# EAGLE design UltiMem64_Color_CPLD (EAGLE 7.7.0)
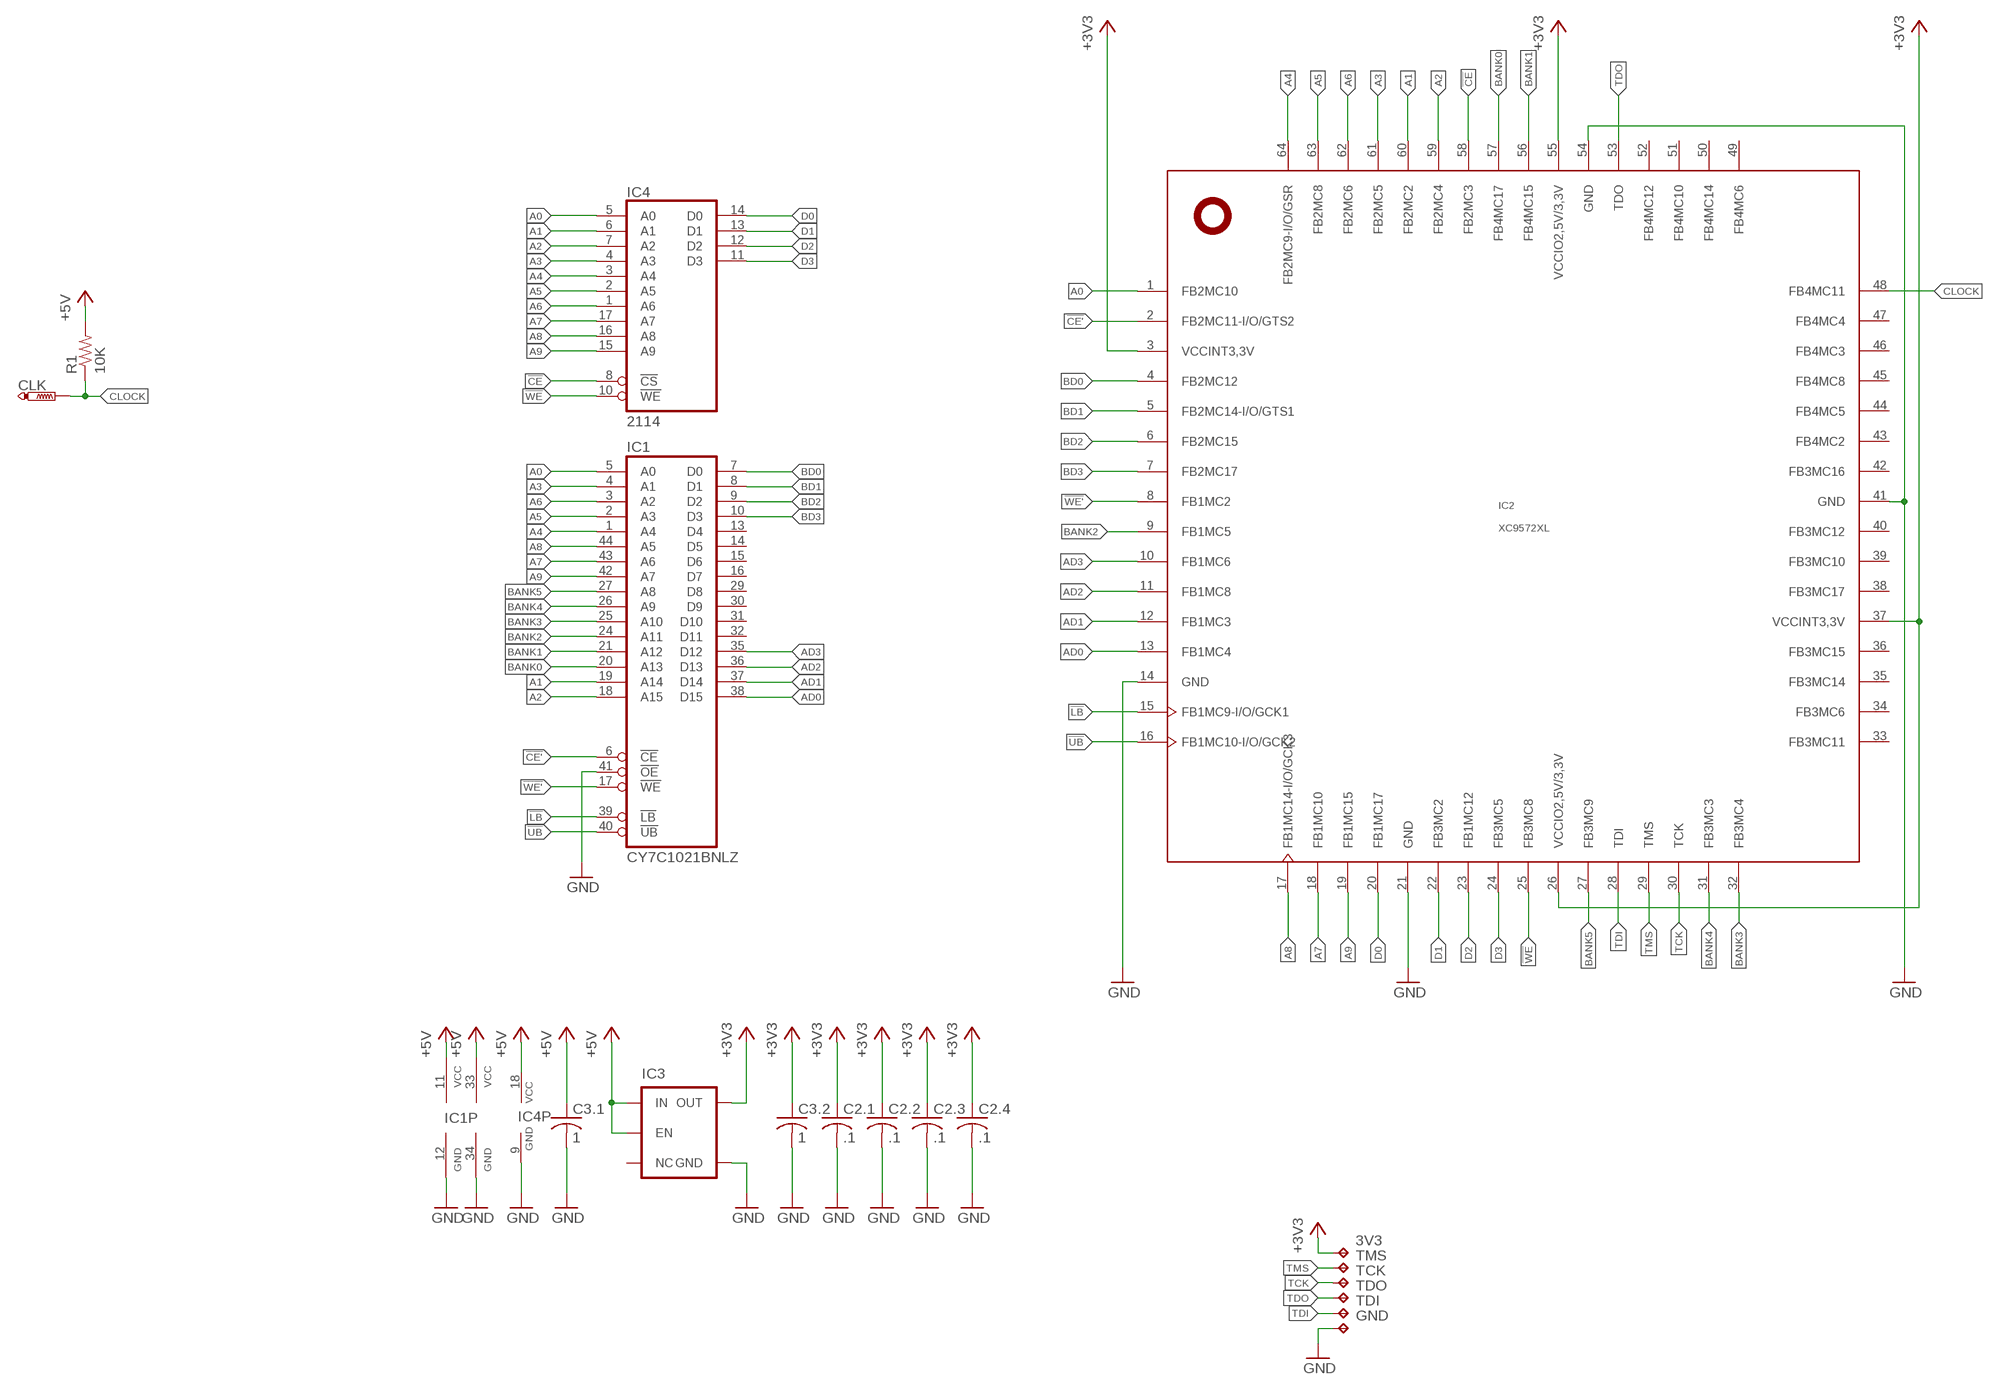
[diagram p0: schematic, sheet 1]

## Parts
3V3  TPTP09R  [TP09R]
C2.1  .1  C-USC0402  [C0402]
C2.2  .1  C-USC0402  [C0402]
C2.3  .1  C-USC0402  [C0402]
C2.4  .1  C-USC0402  [C0402]
C3.1  1  C-USC0402  [C0402]
C3.2  1  C-USC0402  [C0402]
CLK  PTR1PAD1-13  [P1-13]
GND  TPTP09R  [TP09R]
IC1  CY7C1021BNLZ  [TSOP44-II]
IC2  XC9572XL  XC9572XLVQG64  [VQFP64]
IC3  V_REG_TPS76433SOT23-5  [SOT23-5]
IC4  2114  2114-S  [DIL18-SMD-REVERSE]
R1  10K  R-US_R0402  [R0402]
TCK  TPTP09R  [TP09R]
TDI  TPTP09R  [TP09R]
TDO  TPTP09R  [TP09R]
TMS  TPTP09R  [TP09R]

## Nets
!CE: IC2.58(FB2MC3) IC4.8(!CS)
!CE': IC1.6(!CE) IC2.2(FB2MC11-I/O/GTS2)
!LB: IC1.39(!LB) IC2.15(FB1MC9-I/O/GCK1)
!UB: IC1.40(!UB) IC2.16(FB1MC10-I/O/GCK2)
!WE: IC2.25(FB3MC8) IC4.10(!WE)
!WE': IC1.17(!WE) IC2.8(FB1MC2)
+3V3: 3V3.TP C2.1.1 C2.2.1 C2.3.1 C2.4.1 C3.2.1 IC2.3(VCCINT3,3V) IC2.26(VCCIO2,5V/3,3V) IC2.37(VCCINT3,3V) IC2.55(VCCIO2,5V/3,3V) IC3.5(OUT)
+5V: C3.1.1 IC1.11(VCC) IC1.33(VCC) IC3.1(IN) IC3.3(EN) IC4.18(VCC) R1.2
A0: IC1.5(A0) IC2.1(FB2MC10) IC4.5(A0)
A1: IC1.19(A14) IC2.60(FB2MC2) IC4.6(A1)
A2: IC1.18(A15) IC2.59(FB2MC4) IC4.7(A2)
A3: IC1.4(A1) IC2.61(FB2MC5) IC4.4(A3)
A4: IC1.1(A4) IC2.64(FB2MC9-I/O/GSR) IC4.3(A4)
A5: IC1.2(A3) IC2.63(FB2MC8) IC4.2(A5)
A6: IC1.3(A2) IC2.62(FB2MC6) IC4.1(A6)
A7: IC1.43(A6) IC2.18(FB1MC10) IC4.17(A7)
A8: IC1.44(A5) IC2.17(FB1MC14-I/O/GCK3) IC4.16(A8)
A9: IC1.42(A7) IC2.19(FB1MC15) IC4.15(A9)
AD0: IC1.38(D15) IC2.13(FB1MC4)
AD1: IC1.37(D14) IC2.12(FB1MC3)
AD2: IC1.36(D13) IC2.11(FB1MC8)
AD3: IC1.35(D12) IC2.10(FB1MC6)
BANK0: IC1.20(A13) IC2.57(FB4MC17)
BANK1: IC1.21(A12) IC2.56(FB4MC15)
BANK2: IC1.24(A11) IC2.9(FB1MC5)
BANK3: IC1.25(A10) IC2.32(FB3MC4)
BANK4: IC1.26(A9) IC2.31(FB3MC3)
BANK5: IC1.27(A8) IC2.27(FB3MC9)
BD0: IC1.7(D0) IC2.4(FB2MC12)
BD1: IC1.8(D1) IC2.5(FB2MC14-I/O/GTS1)
BD2: IC1.9(D2) IC2.6(FB2MC15)
BD3: IC1.10(D3) IC2.7(FB2MC17)
CLOCK: CLK.TP IC2.48(FB4MC11) R1.1
D0: IC2.20(FB1MC17) IC4.14(D0)
D1: IC2.22(FB3MC2) IC4.13(D1)
D2: IC2.23(FB1MC12) IC4.12(D2)
D3: IC2.24(FB3MC5) IC4.11(D3)
GND: C2.1.2 C2.2.2 C2.3.2 C2.4.2 C3.1.2 C3.2.2 GND.TP IC1.12(GND) IC1.34(GND) IC1.41(!OE) IC2.14(GND) IC2.21(GND) IC2.41(GND) IC2.54(GND) IC3.2(GND) IC4.9(GND)
TCK: IC2.30(TCK) TCK.TP
TDI: IC2.28(TDI) TDI.TP
TDO: IC2.53(TDO) TDO.TP
TMS: IC2.29(TMS) TMS.TP
Unconnected: IC1.13(D4) IC1.14(D5) IC1.15(D6) IC1.16(D7) IC1.29(D8) IC1.30(D9) IC1.31(D10) IC1.32(D11) IC2.33(FB3MC11) IC2.34(FB3MC6) IC2.35(FB3MC14) IC2.36(FB3MC15) IC2.38(FB3MC17) IC2.39(FB3MC10) IC2.40(FB3MC12) IC2.42(FB3MC16) IC2.43(FB4MC2) IC2.44(FB4MC5) IC2.45(FB4MC8) IC2.46(FB4MC3) IC2.47(FB4MC4) IC2.49(FB4MC6) IC2.50(FB4MC14) IC2.51(FB4MC10) IC2.52(FB4MC12) IC3.4(NC)

## Library data of the parts
3V3 GND TCK TDI TDO TMS = testpad:TP: Test pad
C2.1-C2.4 C3.1 C3.2 = resistor:C-US: CAPACITOR, American symbol
CLK = testpad:PTR1: TEST PIN
IC1 = memory-cypress-jlb:CY7C1021BNL
IC2 = xilinx_xc95XXXxl:XC9572XLVQG64
IC3 = SparkFun:V_REG_TPS76433: Voltage Regulator Older TI part. LDO 150mA regulator. No output by-pass cap option. See V_REG_LDO for a better part.
IC4 = memory:2114: MEMORY
R1 = resistor:R-US_: RESISTOR, American symbol

## Board
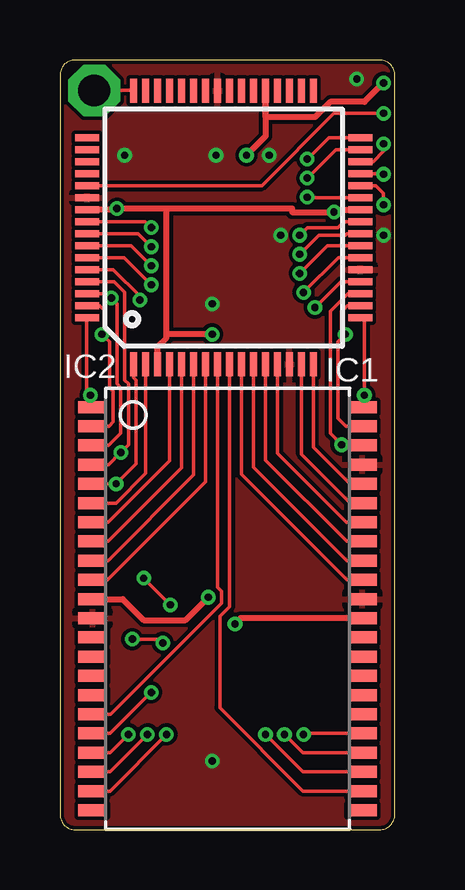
[diagram p1: board, top side]
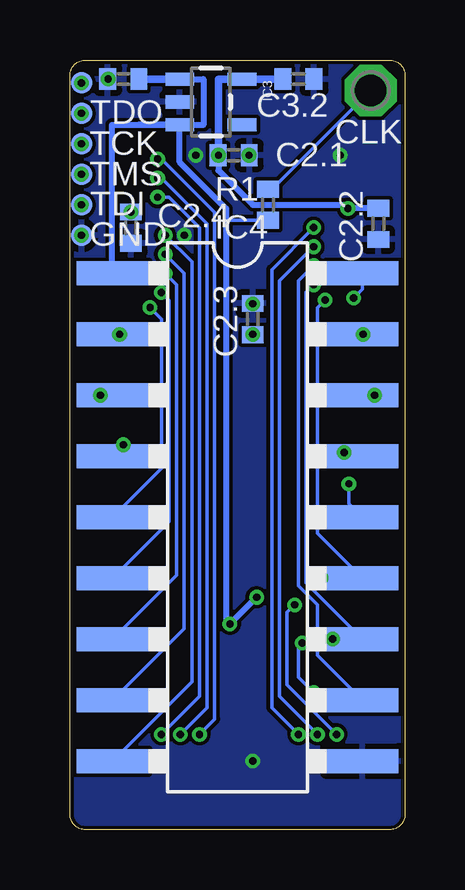
[diagram p2: board, bottom side, seen from below]

Size 13.97 x 32.07 mm. Coordinates in mm from the lower left corner, seen from the top.
Outline: 0,31.43 0,0.63 arc90 0.64,0 13.34,0 arc90 13.97,0.63 13.97,31.43 arc90 13.34,32.07 0.64,32.07 arc90 0,31.43
Copper layers (1*16): Top 0.035mm / dielectric 1.5mm / Bottom 0.035mm
Design rules "hackvana *": minimum track width 6mil, minimum drill 0.3mm, track to track 6mil, track to pad 6mil, pad to pad 6mil, via to via 6mil, smd to smd 0mil, copper to edge 6mil, drill to drill 6mil, minimum pad ring 10mil, minimum via ring 6mil, stop-mask expansion 2mil, vias tented up to drill 100mil, thermal gap 10mil

### Footprints (pad centres in the part's own frame; a part is rotated, then mirrored left to right if it is on the bottom)
TP09R = smd 0.9 x 0.9: TP 0,0
C0402 = smd 0.7 x 0.9: 1 -0.65,0; 2 0.65,0
P1-13 = drill 1.321 pad 2.159 octagon: TP 0,0
TSOP44-II = smd 0.5 x 1.2: 1 -8.4,-5.627; 2 -7.6,-5.627; 3 -6.8,-5.627; 4 -6,-5.627; 5 -5.2,-5.627; 6 -4.4,-5.627; 7 -3.6,-5.627; 8 -2.8,-5.627; 9 -2,-5.627; 10 -1.2,-5.627; 11 -0.4,-5.627; 12 0.4,-5.627; 13 1.2,-5.627; 14 2,-5.627; 15 2.8,-5.627; 16 3.6,-5.627; 17 4.4,-5.627; 18 5.2,-5.627; 19 6,-5.627; 20 6.8,-5.627; 21 7.6,-5.627; 22 8.4,-5.627; 23 8.4,5.627; 24 7.6,5.627; 25 6.8,5.627; 26 6,5.627; 27 5.2,5.627; 28 4.4,5.627; 29 3.6,5.627; 30 2.8,5.627; 31 2,5.627; 32 1.2,5.627; 33 0.4,5.627; 34 -0.4,5.627; 35 -1.2,5.627; 36 -2,5.627; 37 -2.8,5.627; 38 -3.6,5.627; 39 -4.4,5.627; 40 -5.2,5.627; 41 -6,5.627; 42 -6.8,5.627; 43 -7.6,5.627; 44 -8.4,5.627
VQFP64 = smd 1 x 0.3: 1 -5.7,3.75; 2 -5.7,3.25; 3 -5.7,2.75; 4 -5.7,2.25; 5 -5.7,1.75; 6 -5.7,1.25; 7 -5.7,0.75; 8 -5.7,0.25; 9 -5.7,-0.25; 10 -5.7,-0.75; 11 -5.7,-1.25; 12 -5.7,-1.75; 13 -5.7,-2.25; 14 -5.7,-2.75; 15 -5.7,-3.25; 16 -5.7,-3.75; 33 5.7,-3.75; 34 5.7,-3.25; 35 5.7,-2.75; 36 5.7,-2.25; 37 5.7,-1.75; 38 5.7,-1.25; 39 5.7,-0.75; 40 5.7,-0.25; 41 5.7,0.25; 42 5.7,0.75; 43 5.7,1.25; 44 5.7,1.75; 45 5.7,2.25; 46 5.7,2.75; 47 5.7,3.25; 48 5.7,3.75 | smd 0.3 x 1: 17 -3.75,-5.7; 18 -3.25,-5.7; 19 -2.75,-5.7; 20 -2.25,-5.7; 21 -1.75,-5.7; 22 -1.25,-5.7; 23 -0.75,-5.7; 24 -0.25,-5.7; 25 0.25,-5.7; 26 0.75,-5.7; 27 1.25,-5.7; 28 1.75,-5.7; 29 2.25,-5.7; 30 2.75,-5.7; 31 3.25,-5.7; 32 3.75,-5.7; 49 3.75,5.7; 50 3.25,5.7; 51 2.75,5.7; 52 2.25,5.7; 53 1.75,5.7; 54 1.25,5.7; 55 0.75,5.7; 56 0.25,5.7; 57 -0.25,5.7; 58 -0.75,5.7; 59 -1.25,5.7; 60 -1.75,5.7; 61 -2.25,5.7; 62 -2.75,5.7; 63 -3.25,5.7; 64 -3.75,5.7
SOT23-5 = smd 0.55 x 1.2: 1 -0.95,-1.3; 2 0,-1.3; 3 0.95,-1.3; 4 0.95,1.3; 5 -0.95,1.3
DIL18-SMD-REVERSE = smd 1 x 3 bottom: 1 -8.89,-5.205; 2 -6.35,-5.205; 3 -3.81,-5.205; 4 -1.27,-5.205; 5 1.27,-5.205; 6 3.81,-5.205; 7 6.35,-5.205; 8 8.89,-5.205; 9 11.43,-5.205; 10 11.43,5.205; 11 8.89,5.205; 12 6.35,5.205; 13 3.81,5.205; 14 1.27,5.205; 15 -1.27,5.205; 16 -3.81,5.205; 17 -6.35,5.205; 18 -8.89,5.205
R0402 = smd 0.7 x 0.9: 1 -0.65,0; 2 0.65,0

### Placement (x,y rotation side)
3V3  13.49,31.11 270 bottom
C2.1  7.14,28.1 0 bottom
C2.2  1.11,25.24 270 bottom
C2.3  6.35,21.27 90 bottom
C2.4  11.43,25.08 270 bottom
C3.1  11.75,31.27 180 bottom
C3.2  4.45,31.27 0 bottom
CLK  1.43,30.8 0 bottom
GND  13.49,24.76 270 bottom
IC1  6.99,9.21 270 top
IC2  6.83,25.08 90 top
IC3  8.1,30.32 270 bottom
IC4  6.99,14.29 270 top
R1  5.71,26.04 270 bottom
TCK  13.49,28.57 270 bottom
TDI  13.49,26.04 270 bottom
TDO  13.49,29.84 270 bottom
TMS  13.49,27.3 270 bottom

### Tracks (layer width: path | path; a pad name or v marks a point on that pad's centre or on a via)
!CE  (via drill 0.3)
  Top 0.152: IC2.58 2.97,24.33 v3.81,23.49
  Bottom 0.152: IC4.8 3.65,7.27 3.65,9.37 4.45,10.16 4.45,22.86 v3.81,23.49
!CE'
  Top 0.152: IC2.2 3.58,14.85 2.34,13.61 IC1.6
!LB
  Top 0.152: IC1.39 12.11,13.61 10.08,15.64 IC2.15
!UB
  Top 0.152: IC1.40 12.1,14.41 10.58,15.94 IC2.16
!WE  (via drill 0.3)
  Top 0.152: IC2.25 11.84,25.33 11.59,25.08 10.32,25.08 v10,24.76
  Bottom 0.152: IC4.10 8.89,6.16 8.89,23.65 v10,24.76
!WE'
  Top 0.152: IC1.17 2.11,4.81 6.74,9.43 6.74,9.93 6.58,10.09 IC2.8
+3V3  (via drill 0.3)
  Top 0.254: 2.34,25.83 IC2.55 | IC2.3 4.08,20.11 4.45,20.48 4.45,20.64 | 4.45,20.64 4.45,25.88 | 4.45,25.88 v2.38,25.88 | 4.45,25.88 9.68,25.88 9.68,25.73 C2.4.1 11.53,25.83 IC2.26 | v6.35,20.64 4.45,20.64 | v7.78,28.1 8.57,28.89 8.58,28.89 IC2.37 8.58,29.69 10.64,29.69 11.27,30.32 12.7,30.32 3V3.TP
  Top 0.305: v2.38,25.88 2.34,25.83
  Bottom 0.254: C2.2.1 2.37,25.89 | C2.1.1 v7.78,28.1 7.78,27.46 6.35,26.04 2.38,26.04 v2.38,25.88 | C2.3.1 v6.35,20.64
  Bottom 0.305: C3.2.1 IC3.5 7.78,31.27 v7.78,28.1 | 2.37,25.89 v2.38,25.88
  other vias: 11.43,25.73 13.49,31.11
+5V  (via drill 0.3)
  Top 0.254: IC1.11 2.62,9.61 3.49,8.73 5.24,8.73 v6.19,9.68 | IC1.33 7.54,8.81 v7.3,8.57
  Bottom 0.152: R1.2 7.46,25.38
  Bottom 0.254: IC4.18 12.22,23.18 12.22,29.37 IC3.3 | IC3.3 11.1,29.37 | v6.19,9.68 v7.3,8.57 7.46,8.57 7.46,25.38 7.46,25.88 9.4,27.81 IC3.3 | C3.1.1 8.41,31.27 8.41,29.37 | 8.41,29.37 | IC3.3 8.41,29.37
  Bottom 0.305: C3.1.1 IC3.1
A0  (via drill 0.3)
  Top 0.152: IC2.1 3.08,18.83 3.17,18.73 3.17,15.24 v2.34,14.41 IC1.5
  Bottom 0.152: IC4.5 2.34,13.58 v2.34,14.41
A1  (via drill 0.3)
  Top 0.152: IC1.19 2.1,3.21 v2.86,3.97 | v3.49,10.48 v4.6,9.37 | IC2.60 2.23,23.33 3.33,22.22 v3.33,22.07
  Bottom 0.152: v3.49,10.48 IC4.6 3.65,12.35 3.65,21.75 v3.33,22.07 | v4.6,9.37 4.92,9.05 4.92,6.03 v2.86,3.97
A2  (via drill 0.3)
  Top 0.152: IC1.18 2.1,4.01 v3.81,5.72 | v3.02,7.94 4.13,7.94 v4.29,7.78 | IC2.59 2.68,23.83 v3.81,22.7
  Bottom 0.152: v3.02,7.94 IC4.7 4.13,10.28 4.13,22.38 v3.81,22.7 | v4.29,7.78 4.45,7.62 4.45,6.35 v3.81,5.72
A3  (via drill 0.3)
  Top 0.152: IC1.4 2.03,15.21 v2.54,15.72 2.86,16.03 2.86,18.57 2.7,18.73 2.7,22.38 2.25,22.83 IC2.61
  Bottom 0.152: IC4.4 2.38,15.56 v2.54,15.72
A4  (via drill 0.3)
  Top 0.152: 1.36,17.62 IC1.1 1.36,18.1 v1.27,18.1 1.11,18.26 1.11,21.33 IC2.64 1.27,21.33
  Bottom 0.152: v1.27,18.1 IC4.3
A5  (via drill 0.3)
  Top 0.152: IC1.2 2.04,16.81 2.22,16.99 2.22,18.26 2.06,18.42 2.06,20.32 v1.75,20.64 1.91,20.8 1.91,21.59 1.66,21.83 IC2.63
  Bottom 0.152: v1.75,20.64 IC4.2
A6  (via drill 0.3)
  Top 0.152: IC2.62 1.96,22.33 v2.14,22.15 2.38,21.91 2.38,18.57 2.54,18.42 2.54,16.51 2.04,16.01 IC1.3
  Bottom 0.152: IC4.1 1.78,22.51 v2.14,22.15
A7  (via drill 0.3)
  Top 0.152: IC1.43 11.93,16.81 11.59,17.14 11.59,20.32 v11.91,20.64 11.75,20.8 11.75,21.59 11.99,21.83 IC2.18
  Bottom 0.152: v11.91,20.64 IC4.17
A8  (via drill 0.3)
  Top 0.152: IC1.44 12.61,18.1 v12.7,18.1 12.7,21.33 IC2.17
  Bottom 0.152: v12.7,18.1 IC4.16
A9  (via drill 0.3)
  Top 0.152: IC1.42 11.77,16.01 v11.75,16.03 11.27,16.51 11.27,21.59 12.01,22.33 IC2.19
  Bottom 0.152: IC4.15 12.19,15.59 v11.75,16.03
AD0
  Top 0.152: IC2.13 9.08,15.69 11.96,12.81 IC1.38
AD1
  Top 0.152: IC2.12 8.58,15.39 11.96,12.01 IC1.37
AD2
  Top 0.152: IC2.11 8.08,15.1 11.97,11.21 IC1.36
AD3
  Top 0.152: IC2.10 7.58,14.81 11.98,10.41 IC1.35
BANK0  (via drill 0.3)
  Top 0.152: IC1.20 2.09,2.41 v3.65,3.97 | IC2.57 3.27,24.83 v3.81,24.29
  Bottom 0.152: v3.65,3.97 5.24,5.56 5.24,22.86 v3.81,24.29
BANK1  (via drill 0.3)
  Top 0.152: IC1.21 2.08,1.61 v4.45,3.97 | IC2.56 3.56,25.33 v3.81,25.08
  Bottom 0.152: v4.45,3.97 5.56,5.08 5.56,23.34 v3.81,25.08
BANK2
  Top 0.152: IC1.24 10.14,1.61 6.67,5.08 6.67,8.89 7.06,9.29 7.08,9.29 IC2.9
BANK3  (via drill 0.3)
  Top 0.152: IC1.25 10.13,2.41 v8.57,3.97 | IC2.32 11.21,28.83 v10.32,27.94
  Bottom 0.152: v8.57,3.97 7.94,4.6 7.94,25.72 10.16,27.94 v10.32,27.94
BANK4  (via drill 0.3)
  Top 0.152: IC1.26 10.13,3.21 v9.37,3.97 | IC2.31 11.51,28.33 v10.32,27.15
  Bottom 0.152: v9.37,3.97 8.26,5.08 8.26,25.24 10.16,27.15 v10.32,27.15
BANK5  (via drill 0.3)
  Top 0.152: IC1.27 10.2,4.01 v10.16,3.97 | IC2.27 10.3,26.33 v10.32,26.35
  Bottom 0.152: v10.16,3.97 8.57,5.56 8.57,25.08 9.84,26.35 v10.32,26.35
BD0
  Top 0.152: IC2.4 4.58,15.37 2.01,12.81 IC1.7
BD1
  Top 0.152: IC2.5 5.08,15.08 2.01,12.01 IC1.8
BD2
  Top 0.152: IC2.6 5.58,14.78 2,11.21 IC1.9
BD3
  Top 0.152: IC2.7 6.08,14.49 1.99,10.41 IC1.10
CLOCK
  Top 0.152: IC2.48 3.06,30.8 CLK.TP
  Bottom 0.152: CLK.TP 5.54,26.69 R1.1
D0  (via drill 0.3)
  Top 0.152: IC2.20 11.72,22.83 v10.64,21.75
  Bottom 0.152: IC4.14 10.16,15.05 10.16,21.27 v10.64,21.75
D1  (via drill 0.3)
  Top 0.152: IC2.22 11.61,23.83 v10.16,22.38
  Bottom 0.152: IC4.13 9.84,12.83 9.84,22.07 v10.16,22.38
D2  (via drill 0.3)
  Top 0.152: IC2.23 11.16,24.33 v10,23.18
  Bottom 0.152: IC4.12 9.53,10.6 9.53,22.7 v10,23.18
D3  (via drill 0.3)
  Top 0.152: IC2.24 11.97,24.83 11.91,24.76 10.79,24.76 v10,23.97
  Bottom 0.152: IC4.11 9.21,8.38 9.21,23.18 v10,23.97
GND  (via drill 0.3)
  other vias: 13.49,24.76 6.35,2.86 6.35,21.91 8.73,28.1 9.21,24.76 6.51,28.1 12.38,31.27 2.7,28.1
  pour Top: 13.97,31.43 13.97,0.63 arc-90 13.34,0 0.64,0 arc-90 0,0.63 0,31.43 arc-90 0.64,32.07 13.34,32.07 arc-90
  pour Bottom: 13.97,31.43 13.97,0.63 arc-90 13.34,0 0.64,0 arc-90 0,0.63 0,31.43 arc-90 0.64,32.07 13.34,32.07 arc-90
TCK  (via drill 0.3)
  Top 0.152: IC2.30 13.07,27.83 13.49,28.26 TCK.TP
  other vias: 13.49,28.57
TDI  (via drill 0.3)
  Top 0.152: IC2.28 13.17,26.83 13.49,26.51 TDI.TP
  other vias: 13.49,26.04
TDO  (via drill 0.3)
  Top 0.152: IC2.53 8.42,26.83 11.43,29.85 TDO.TP
  other vias: 13.49,29.84
TMS  (via drill 0.3)
  Top 0.152: IC2.29 13.47,27.33 TMS.TP
  other vias: 13.49,27.3